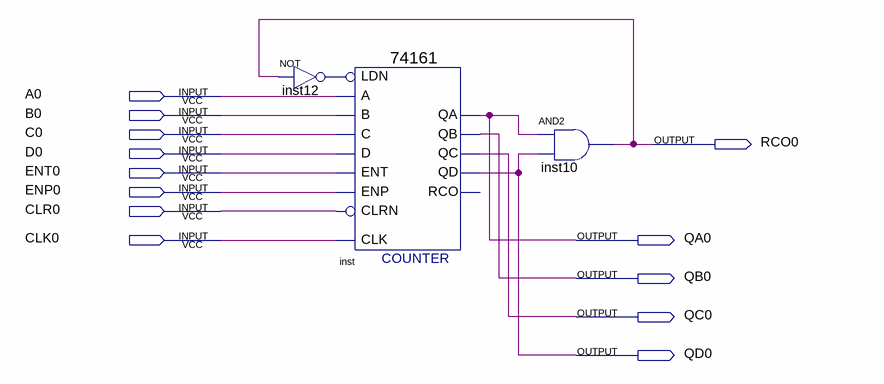
[diagram p0: schematic sheet]
// Quartus schematic Block1.bdf as structural Verilog: 3 symbols, 13 pins
module Block1 (
  input  A0,
  input  B0,
  input  C0,
  input  D0,
  input  ENT0,
  input  ENP0,
  input  CLR0,
  input  CLK0,
  output RCO0,
  output QA0,
  output QB0,
  output QC0,
  output QD0
);

  wire inst12_out;

  not inst12 (inst12_out, RCO0);
  \74161  inst (
    .CLRN(CLR0), .CLK(CLK0), .ENP(ENP0), .LDN(inst12_out), .A(A0), .D(D0), .ENT(ENT0), .B(B0), .C(C0),
    .QD(QD0), .QC(QC0), .QB(QB0), .QA(QA0));  // open: RCO
  and inst10 (RCO0, QA0, QD0);
endmodule
